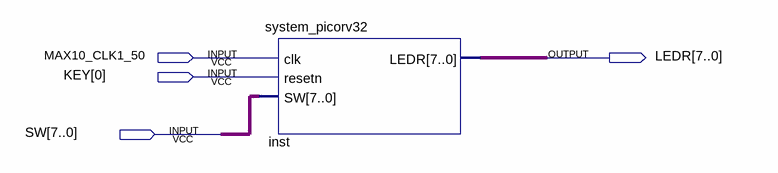
[diagram p0: schematic sheet]
// Quartus schematic quartus_mini_sys_riscv.bdf as structural Verilog: 1 symbols, 4 pins
module quartus_mini_sys_riscv (
  input  MAX10_CLK1_50,
  input  [0:0] KEY,
  input  [7:0] SW,
  output [7:0] LEDR
);

  system_picorv32 inst (.clk(MAX10_CLK1_50), .resetn(KEY[0]), .SW(SW), .LEDR(LEDR));
endmodule
